# EAGLE design sandwich (EAGLE 6.4)
Sandwich v0.00 low cost CNC/3D printer controller
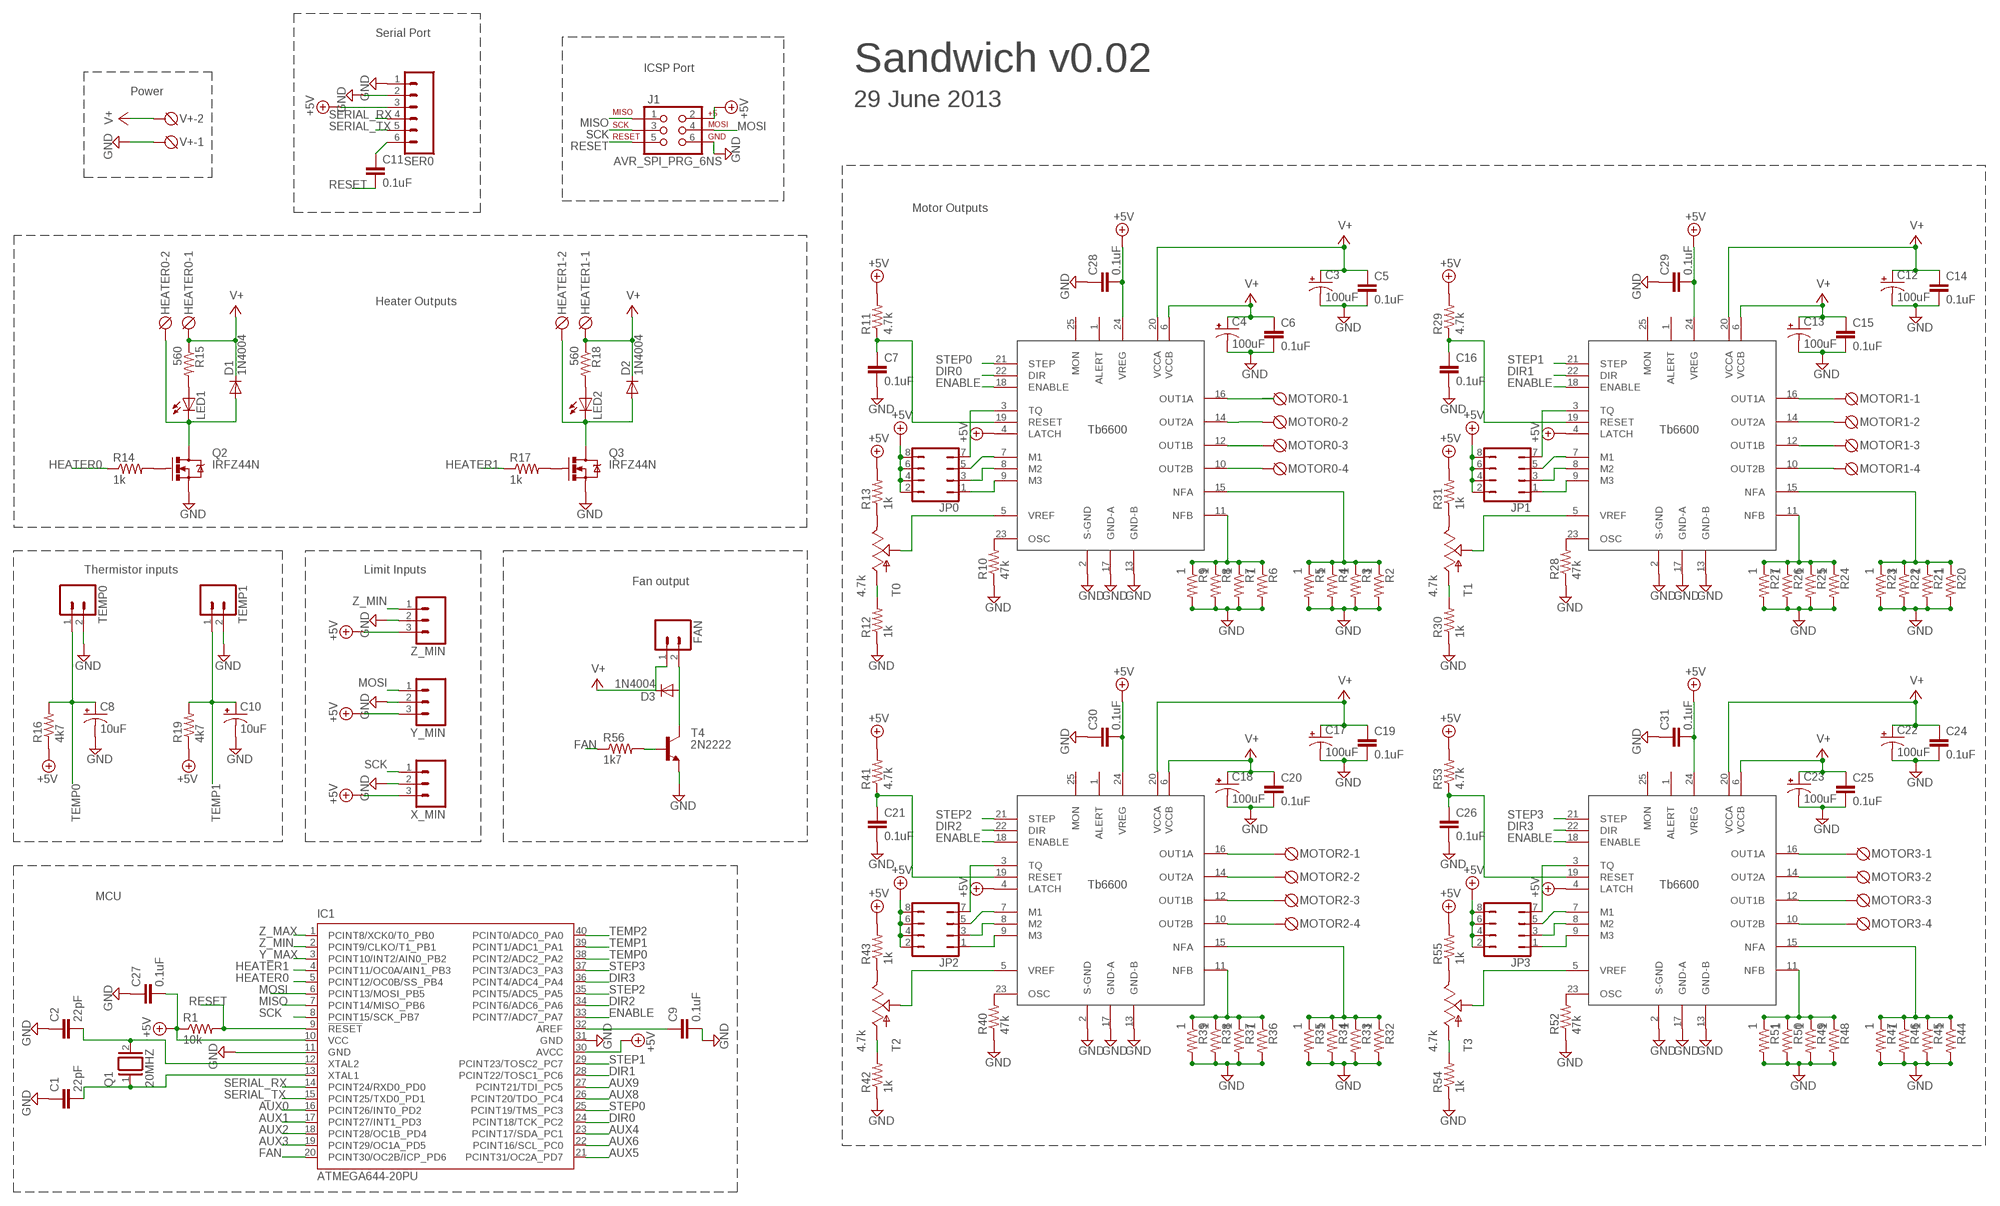
[diagram p0: schematic, sheet 1]

## Parts
C1  22pF  CAPPTH2  [CAP-PTH-SMALL2]
C2  22pF  CAPPTH2  [CAP-PTH-SMALL2]
C3  100uF  CAP_POLPTH2  [CPOL-RADIAL-10UF-25V]
C4  100uF  CAP_POLPTH2  [CPOL-RADIAL-10UF-25V]
C5  0.1uF  CAPPTH  [CAP-PTH-SMALL]
C6  0.1uF  CAPPTH  [CAP-PTH-SMALL]
C7  0.1uF  CAPPTH  [CAP-PTH-SMALL]
C8  10uF  CAP_POLPTH2  [CPOL-RADIAL-10UF-25V]
C9  0.1uF  CAPPTH  [CAP-PTH-SMALL]
C10  10uF  CAP_POLPTH2  [CPOL-RADIAL-10UF-25V]
C11  0.1uF  CAPPTH  [CAP-PTH-SMALL]
C12  100uF  CAP_POLPTH2  [CPOL-RADIAL-10UF-25V]
C13  100uF  CAP_POLPTH2  [CPOL-RADIAL-10UF-25V]
C14  0.1uF  CAPPTH  [CAP-PTH-SMALL]
C15  0.1uF  CAPPTH  [CAP-PTH-SMALL]
C16  0.1uF  CAPPTH  [CAP-PTH-SMALL]
C17  100uF  CAP_POLPTH2  [CPOL-RADIAL-10UF-25V]
C18  100uF  CAP_POLPTH2  [CPOL-RADIAL-10UF-25V]
C19  0.1uF  CAPPTH  [CAP-PTH-SMALL]
C20  0.1uF  CAPPTH  [CAP-PTH-SMALL]
C21  0.1uF  CAPPTH  [CAP-PTH-SMALL]
C22  100uF  CAP_POLPTH2  [CPOL-RADIAL-10UF-25V]
C23  100uF  CAP_POLPTH2  [CPOL-RADIAL-10UF-25V]
C24  0.1uF  CAPPTH  [CAP-PTH-SMALL]
C25  0.1uF  CAPPTH  [CAP-PTH-SMALL]
C26  0.1uF  CAPPTH  [CAP-PTH-SMALL]
C27  0.1uF  CAPPTH  [CAP-PTH-SMALL]
C28  0.1uF  CAPPTH  [CAP-PTH-SMALL]
C29  0.1uF  CAPPTH  [CAP-PTH-SMALL]
C30  0.1uF  CAPPTH  [CAP-PTH-SMALL]
C31  0.1uF  CAPPTH  [CAP-PTH-SMALL]
D1  1N4004  [DO41-10]
D2  1N4004  [DO41-10]
D3  1N4004  DIODEPTH  [DIODE-1N4001]
FAN  M02PTH3  [1X02_LONGPADS]
HEATER0  DG3XX-02-3.5  [DG350-3.5-02P]
HEATER1  DG3XX-02-3.5  [DG350-3.5-02P]
IC1  ATMEGA644-20PU  [DIL40]
J1  AVR_SPI_PRG_6NS  [2X3-NS]
JP0  JP4Q  [JP4Q]
JP1  JP4Q  [JP4Q]
JP2  JP4Q  [JP4Q]
JP3  JP4Q  [JP4Q]
LED1  LED5MM  [LED5MM]
LED2  LED5MM  [LED5MM]
MOTOR0  DG3XX-04-3.5  [DG350-3.5-04P]
MOTOR1  DG3XX-04-3.5  [DG350-3.5-04P]
MOTOR2  DG3XX-04-3.5  [DG350-3.5-04P]
MOTOR3  DG3XX-04-3.5  [DG350-3.5-04P]
Q1  20MHZ  XTAL/S  [QS]
Q2  IRFZ44N  MOSFET-NCHANNELFQP30N06L  [TO220V]
Q3  IRFZ44N  MOSFET-NCHANNELFQP30N06L  [TO220V]
R1  10k  R-US_0204/2V  [0204V]
R2  1  R-US_0204/2V  [0204V]
R3  1  R-US_0204/2V  [0204V]
R4  1  R-US_0204/2V  [0204V]
R5  1  R-US_0204/2V  [0204V]
R6  1  R-US_0204/2V  [0204V]
R7  1  R-US_0204/2V  [0204V]
R8  1  R-US_0204/2V  [0204V]
R9  1  R-US_0204/2V  [0204V]
R10  47k  R-US_0204/2V  [0204V]
R11  4.7k  R-US_0204/2V  [0204V]
R12  1k  R-US_0204/2V  [0204V]
R13  1k  R-US_0204/2V  [0204V]
R14  1k  R-US_0204/2V  [0204V]
R15  560  R-US_0204/2V  [0204V]
R16  4k7  R-US_0204/2V  [0204V]
R17  1k  R-US_0204/2V  [0204V]
R18  560  R-US_0204/2V  [0204V]
R19  4k7  R-US_0204/2V  [0204V]
R20  1  R-US_0204/2V  [0204V]
R21  1  R-US_0204/2V  [0204V]
R22  1  R-US_0204/2V  [0204V]
R23  1  R-US_0204/2V  [0204V]
R24  1  R-US_0204/2V  [0204V]
R25  1  R-US_0204/2V  [0204V]
R26  1  R-US_0204/2V  [0204V]
R27  1  R-US_0204/2V  [0204V]
R28  47k  R-US_0204/2V  [0204V]
R29  4.7k  R-US_0204/2V  [0204V]
R30  1k  R-US_0204/2V  [0204V]
R31  1k  R-US_0204/2V  [0204V]
R32  1  R-US_0204/2V  [0204V]
R33  1  R-US_0204/2V  [0204V]
R34  1  R-US_0204/2V  [0204V]
R35  1  R-US_0204/2V  [0204V]
R36  1  R-US_0204/2V  [0204V]
R37  1  R-US_0204/2V  [0204V]
R38  1  R-US_0204/2V  [0204V]
R39  1  R-US_0204/2V  [0204V]
R40  47k  R-US_0204/2V  [0204V]
R41  4.7k  R-US_0204/2V  [0204V]
R42  1k  R-US_0204/2V  [0204V]
R43  1k  R-US_0204/2V  [0204V]
R44  1  R-US_0204/2V  [0204V]
R45  1  R-US_0204/2V  [0204V]
R46  1  R-US_0204/2V  [0204V]
R47  1  R-US_0204/2V  [0204V]
R48  1  R-US_0204/2V  [0204V]
R49  1  R-US_0204/2V  [0204V]
R50  1  R-US_0204/2V  [0204V]
R51  1  R-US_0204/2V  [0204V]
R52  47k  R-US_0204/2V  [0204V]
R53  4.7k  R-US_0204/2V  [0204V]
R54  1k  R-US_0204/2V  [0204V]
R55  1k  R-US_0204/2V  [0204V]
R56  1k7  R-US_0204/2V  [0204V]
SER0  M06SIP  [1X06]
T0  4.7k  POTTRIM  [TRIM_POT]
T1  4.7k  POTTRIM  [TRIM_POT]
T2  4.7k  POTTRIM  [TRIM_POT]
T3  4.7k  POTTRIM  [TRIM_POT]
T4  2N2222  [TO18]
TEMP0  M02PTH3  [1X02_LONGPADS]
TEMP1  M02PTH3  [1X02_LONGPADS]
U$1  TB6600HG  [P-HZIP25-1.00G]
U$2  TB6600HG  [P-HZIP25-1.00G]
U$3  TB6600HG  [P-HZIP25-1.00G]
U$4  TB6600HG  [P-HZIP25-1.00G]
V+  DG3XX-02-3.5  [DG350-3.5-02P]
X_MIN  M03LONGPADS  [1X03_LONGPADS]
Y_MIN  M03LONGPADS  [1X03_LONGPADS]
Z_MIN  M03LONGPADS  [1X03_LONGPADS]

## Nets
+5V: C27.2 C28.2 C29.2 C30.2 C31.2 IC1.10(VCC) IC1.30(AVCC) J1.2 JP0.2 JP0.4 JP0.6 JP0.8 JP1.2 JP1.4 JP1.6 JP1.8 JP2.2 JP2.4 JP2.6 JP2.8 JP3.2 JP3.4 JP3.6 JP3.8 R1.1 R11.2 R13.2 R16.1 R19.1 R29.2 R31.2 R41.2 R43.2 R53.2 R55.2 SER0.3 U$1.4(LATCH) U$1.24(VREG) U$2.4(LATCH) U$2.24(VREG) U$3.4(LATCH) U$3.24(VREG) U$4.4(LATCH) U$4.24(VREG) X_MIN.3 Y_MIN.3 Z_MIN.3
AUX0: IC1.16(PCINT26/INT0_PD2)
AUX1: IC1.17(PCINT27/INT1_PD3)
AUX2: IC1.18(PCINT28/OC1B_PD4)
AUX3: IC1.19(PCINT29/OC1A_PD5)
AUX4: IC1.23(PCINT17/SDA_PC1)
AUX5: IC1.21(PCINT31/OC2A_PD7)
AUX6: IC1.22(PCINT16/SCL_PC0)
AUX8: IC1.26(PCINT20/TDO_PC4)
AUX9: IC1.27(PCINT21/TDI_PC5)
DIR0: IC1.24(PCINT18/TCK_PC2) U$1.22(DIR)
DIR1: IC1.28(PCINT22/TOSC1_PC6) U$2.22(DIR)
DIR2: IC1.34(PCINT6/ADC6_PA6) U$3.22(DIR)
DIR3: IC1.36(PCINT4/ADC4_PA4) U$4.22(DIR)
ENABLE: IC1.33(PCINT7/ADC7_PA7) U$1.18(ENABLE) U$2.18(ENABLE) U$3.18(ENABLE) U$4.18(ENABLE)
FAN: IC1.20(PCINT30/OC2B/ICP_PD6) R56.1
GND: C1.1 C2.1 C3.2(-) C4.2(-) C5.2 C6.2 C7.2 C8.2(-) C9.2 C10.2(-) C12.2(-) C13.2(-) C14.2 C15.2 C16.2 C17.2(-) C18.2(-) C19.2 C20.2 C21.2 C22.2(-) C23.2(-) C24.2 C25.2 C26.2 C27.1 C28.1 C29.1 C30.1 C31.1 IC1.11(GND) IC1.31(GND) J1.6 Q2.3(S) Q3.3(S) R2.2 R3.2 R4.2 R5.2 R6.2 R7.2 R8.2 R9.2 R10.1 R12.1 R20.2 R21.2 R22.2 R23.2 R24.2 R25.2 R26.2 R27.2 R28.1 R30.1 R32.2 R33.2 R34.2 R35.2 R36.2 R37.2 R38.2 R39.2 R40.1 R42.1 R44.2 R45.2 R46.2 R47.2 R48.2 R49.2 R50.2 R51.2 R52.1 R54.1 SER0.1 SER0.2 T4.1(E) TEMP0.2 TEMP1.2 U$1.2(S-GND) U$1.13(GND-B) U$1.17(GND-A) U$2.2(S-GND) U$2.13(GND-B) U$2.17(GND-A) U$3.2(S-GND) U$3.13(GND-B) U$3.17(GND-A) U$4.2(S-GND) U$4.13(GND-B) U$4.17(GND-A) V+.1 X_MIN.2 Y_MIN.2 Z_MIN.2
HEATER0: IC1.5(PCINT12/OC0B/SS_PB4) R14.1
HEATER1: IC1.4(PCINT11/OC0A/AIN1_PB3) R17.1
MISO: IC1.7(PCINT14/MISO_PB6) J1.1
MOSI: IC1.6(PCINT13/MOSI_PB5) J1.4 Y_MIN.1
N$1: C2.2 IC1.12(XTAL2) Q1.2
N$2: C1.2 IC1.13(XTAL1) Q1.1
N$3: R10.2 U$1.23(OSC)
N$4: R2.1 R3.1 R4.1 R5.1 U$1.15(NFA)
N$5: R6.1 R7.1 R8.1 R9.1 U$1.11(NFB)
N$6 [motor]: MOTOR0.4 U$1.10(OUT2B)
N$7 [motor]: MOTOR0.3 U$1.12(OUT1B)
N$8 [motor]: MOTOR0.2 U$1.14(OUT2A)
N$9 [motor]: MOTOR0.1 U$1.16(OUT1A)
N$10: R12.2 T0.3(A)
N$11: R13.1 T0.2(E)
N$12: T0.1(S) U$1.5(VREF)
N$13: Q2.1(G) R14.2
N$14: LED1.A R15.2
N$15 [heater]: D1.A HEATER0.2 LED1.K(C) Q2.2(D)
N$16: C7.1 R11.1 U$1.19(RESET)
N$17: C9.1 IC1.32(AREF)
N$18: JP0.1 U$1.9(M3)
N$19: Q3.1(G) R17.2
N$20: LED2.A R18.2
N$21 [heater]: D2.A HEATER1.2 LED2.K(C) Q3.2(D)
N$22: JP0.3 U$1.8(M2)
N$23: JP0.5 U$1.7(M1)
N$24: JP0.7 U$1.3(TQ)
N$25: C11.1 SER0.6
N$26: D3.A FAN.2 T4.3(C)
N$27: R20.1 R21.1 R22.1 R23.1 U$2.15(NFA)
N$28: R24.1 R25.1 R26.1 R27.1 U$2.11(NFB)
N$29: R28.2 U$2.23(OSC)
N$30 [motor]: MOTOR1.1 U$2.16(OUT1A)
N$31 [motor]: MOTOR1.2 U$2.14(OUT2A)
N$32 [motor]: MOTOR1.3 U$2.12(OUT1B)
N$33 [motor]: MOTOR1.4 U$2.10(OUT2B)
N$34: C16.1 R29.1 U$2.19(RESET)
N$35: R30.2 T1.3(A)
N$36: R31.1 T1.2(E)
N$37: T1.1(S) U$2.5(VREF)
N$38: JP1.1 U$2.9(M3)
N$39: JP1.3 U$2.8(M2)
N$40: JP1.5 U$2.7(M1)
N$41: JP1.7 U$2.3(TQ)
N$42: R32.1 R33.1 R34.1 R35.1 U$3.15(NFA)
N$43: R36.1 R37.1 R38.1 R39.1 U$3.11(NFB)
N$44: R40.2 U$3.23(OSC)
N$45 [motor]: MOTOR2.1 U$3.16(OUT1A)
N$46 [motor]: MOTOR2.2 U$3.14(OUT2A)
N$47 [motor]: MOTOR2.3 U$3.12(OUT1B)
N$48 [motor]: MOTOR2.4 U$3.10(OUT2B)
N$49: C21.1 R41.1 U$3.19(RESET)
N$50: R42.2 T2.3(A)
N$51: R43.1 T2.2(E)
N$52: T2.1(S) U$3.5(VREF)
N$53: JP2.1 U$3.9(M3)
N$54: JP2.3 U$3.8(M2)
N$55: JP2.5 U$3.7(M1)
N$56: JP2.7 U$3.3(TQ)
N$57: R44.1 R45.1 R46.1 R47.1 U$4.15(NFA)
N$58: R48.1 R49.1 R50.1 R51.1 U$4.11(NFB)
N$59: R52.2 U$4.23(OSC)
N$60 [motor]: MOTOR3.1 U$4.16(OUT1A)
N$61 [motor]: MOTOR3.2 U$4.14(OUT2A)
N$62 [motor]: MOTOR3.3 U$4.12(OUT1B)
N$63 [motor]: MOTOR3.4 U$4.10(OUT2B)
N$64: C26.1 R53.1 U$4.19(RESET)
N$65: R54.2 T3.3(A)
N$66: R55.1 T3.2(E)
N$67: T3.1(S) U$4.5(VREF)
N$68: JP3.1 U$4.9(M3)
N$69: JP3.3 U$4.8(M2)
N$70: JP3.5 U$4.7(M1)
N$71: JP3.7 U$4.3(TQ)
N$73: R56.2 T4.2(B)
RESET: C11.2 IC1.9(!RESET) J1.5 R1.2
SCK: IC1.8(PCINT15/SCK_PB7) J1.3 X_MIN.1
SERIAL_RX: IC1.14(PCINT24/RXD0_PD0) SER0.4
SERIAL_TX: IC1.15(PCINT25/TXD0_PD1) SER0.5
STEP0: IC1.25(PCINT19/TMS_PC3) U$1.21(STEP)
STEP1: IC1.29(PCINT23/TOSC2_PC7) U$2.21(STEP)
STEP2: IC1.35(PCINT5/ADC5_PA5) U$3.21(STEP)
STEP3: IC1.37(PCINT3/ADC3_PA3) U$4.21(STEP)
TEMP0: C8.1(+) IC1.38(PCINT2/ADC2_PA2) R16.2 TEMP0.1
TEMP1: C10.1(+) IC1.39(PCINT1/ADC1_PA1) R19.2 TEMP1.1
TEMP2: IC1.40(PCINT0/ADC0_PA0)
V+ [heater]: C3.1(+) C4.1(+) C5.1 C6.1 C12.1(+) C13.1(+) C14.1 C15.1 C17.1(+) C18.1(+) C19.1 C20.1 C22.1(+) C23.1(+) C24.1 C25.1 D1.C D2.C D3.C FAN.1 HEATER0.1 HEATER1.1 R15.1 R18.1 U$1.6(VCCB) U$1.20(VCCA) U$2.6(VCCB) U$2.20(VCCA) U$3.6(VCCB) U$3.20(VCCA) U$4.6(VCCB) U$4.20(VCCA) V+.2
Y_MAX: IC1.3(PCINT10/INT2/AIN0_PB2)
Z_MAX: IC1.1(PCINT8/XCK0/T0_PB0)
Z_MIN: IC1.2(PCINT9/CLKO/T1_PB1) Z_MIN.1
Unconnected: U$1.1(ALERT) U$1.25(MON) U$2.1(ALERT) U$2.25(MON) U$3.1(ALERT) U$3.25(MON) U$4.1(ALERT) U$4.25(MON)

## Notes on the sheet
- Serial Port
- ICSP Port | Sandwich v0.02
- Power
- 29 June 2013
- Motor Outputs
- Heater Outputs
- Thermistor inputs | Limit Inputs
- Fan output
- MCU

## Library data of the parts
C1 C2 C5-C7 C9 C14-C16 C19-C21 C24-C31 = SparkFun-Capacitors:CAP: Capacitor Standard 0603 ceramic capacitor, and 0.1" leaded capacitor.
C3 C4 C12 C13 C17 C18 C22 C23 = SparkFun-Passives:CAP_POL: Capacitor Polarized These are standard SMD and PTH capacitors. Normally 10uF, 47uF, and 100uF in electrolytic and tantalum varieties. Always verify the external diameter of the through hole cap, it varies with capacity, voltage, and manufacturer. The EIA devices should be standard.
C8 C10 = SparkFun-Capacitors:CAP_POL: Capacitor Polarized These are standard SMD and PTH capacitors. Normally 10uF, 47uF, and 100uF in electrolytic and tantalum varieties. Always verify the external diameter of the through hole cap, it varies with capacity, voltage, and manufacturer. The EIA devices should be standard.
C11 = SparkFun-Passives:CAP: Capacitor Standard 0603 ceramic capacitor, and 0.1" leaded capacitor.
D1 D2 = diode:1N4004: DIODE general purpose rectifier, 1 A
D3 = SparkFun-DiscreteSemi:DIODE: Diode These are standard reverse protection diodes and small signal diodes. SMA package can handle up to about 1A. SOD-323 can handle about 200mA. What the SOD-323 package when ordering, there are some mfgs out there that are 5-pin packages.
FAN TEMP0 TEMP1 = SparkFun-Connectors:M02: Header 2 Standard 2-pin 0.1" header. Use with straight break away headers (SKU : PRT-00116), right angle break away headers (PRT-00553), swiss pins (PRT-00743), machine pins (PRT-00117), and female headers (PRT-00115). Molex polarized connector foot print use with SKU : PRT-08233 with associated crimp pins and housings.
HEATER0 HEATER1 V+ = degson:DG3XX-02: DG350-3.5-02P DG306-5.0-02P
IC1 = atmel:ATMEGA644-*PU: 8-bit Microcontroller with 64K Bytes In-System Programmable Flash Auto generated by make-symbol-device-package-bsdl.ulp Rev. 34 Source: http://www.atmel.com/dyn/resources/prod_documents/doc2593.pdf; MPN: ATMEGA644-20PU; OC_FARNELL: 1288340; OC_NEWARK: 23M5060
J1 = SparkFun-Connectors:AVR_SPI_PRG_6: AVR ISP 6 Pin This is the reduced ISP connector for AVR programming. Common on Arduino. This footprint will take up less PCB space and can be used with a 10-pin to 6-pin adapter such as SKU: BOB-08508
JP0 JP1-JP3 = jumper:JP4Q: JUMPER
LED1 LED2 = led:LED: LED OSRAM: - CHIPLED LG R971, LG N971, LY N971, LG Q971, LY Q971, LO R971, LY R971 LH N974, LH R974 LS Q976, LO Q976, LY Q976 LO Q996 - Hyper CHIPLED LW Q18S LB Q993, LB Q99A, LB R99A - SideLED LS A670, LO A670, LY A670, LG A670, LP A670 LB A673, LV A673, LT A673, LW A673 LH A674 LY A675 LS A676, LA A676, LO A676, LY A676, LW A676 LS A679, LY A679, LG A679 - Hyper Micro SIDELED® LS Y876, LA Y876, LO Y876, LY Y876 LT Y87S - SmartLED LW L88C, LW L88S LB L89C, LB L89S, LG L890 LS L89K, LO L89K, LY L89K LS L896, LA L896, LO L896, LY L896 - TOPLED LS T670, LO T670, LY T670, LG T670, LP T670 LSG T670, LSP T670, LSY T670, LOP T670, LYG T670 LG T671, LOG T671, LSG T671 LB T673, LV T673, LT T673, LW T673 LH T674 LS T676, LA T676, LO T676, LY T676, LB T676, LH T676, LSB T676, LW T676 LB T67C, LV T67C, LT T67C, LS T67K, LO T67K, LY T67K, LW E67C LS E67B, LA E67B, LO E67B, LY E67B, LB E67C, LV E67C, LT E67C LW T67C LS T679, LY T679, LG T679 LS T770, LO T770, LY T770, LG T770, LP T770 LB T773, LV T773, LT T773, LW T773 LH T774 LS E675, LA E675, LY E675, LS T675 LS T776, LA T776, LO T776, LY T776, LB T776 LHGB T686 LT T68C, LB T68C - Hyper Mini TOPLED® LB M676 - Mini TOPLED Santana® LG M470 LS M47K, LO M47K, LY M47K Source: http://www.osram.convergy.de LUXEON: - LUMILED® LXK2-PW12-R00, LXK2-PW12-S00, LXK2-PW14-U00, LXK2-PW14-V00 LXK2-PM12-R00, LXK2-PM12-S00, LXK2-PM14-U00 LXK2-PE12-Q00, LXK2-PE12-R00, LXK2-PE12-S00, LXK2-PE14-T00, LXK2-PE14-U00 LXK2-PB12-K00, LXK2-PB12-L00, LXK2-PB12-M00, LXK2-PB14-N00, LXK2-PB14-P00, LXK2-PB14-Q00 LXK2-PR12-L00, LXK2-PR12-M00, LXK2-PR14-Q00, LXK2-PR14-R00 LXK2-PD12-Q00, LXK2-PD12-R00, LXK2-PD12-S00 LXK2-PH12-R00, LXK2-PH12-S00 LXK2-PL12-P00, LXK2-PL12-Q00, LXK2-PL12-R00 Source: www.luxeon.com KINGBRIGHT: KA-3528ASYC Source: www.kingbright.com
MOTOR0 MOTOR1-MOTOR3 = degson:DG3XX-04: DG350-3.5-04P DG306-5.0-04P
Q1 = special:XTAL/S: CRYSTAL
Q2 Q3 = SparkFun-DiscreteSemi:MOSFET-NCHANNEL: Common NMOSFET Parts MFG P/N Store ID Prod ID FDD8780 TRANS-09984 SI7820DN TRANS-11055 FDS6630A IC-08089 2N7002PW TRANS-11151 FQP30N06L COM-10213 TRANS-10060 BSS123LT1G TRANS-08345 BSS138 TRANS-00830 BS170 2N7000; PROD_ID: TRANS-10060
R1-R56 = resistor:R-US_: RESISTOR, American symbol
SER0 = SparkFun-Connectors:M06: Header 6 Standard 6-pin 0.1" header. Use with straight break away headers (SKU : PRT-00116), right angle break away headers (PRT-00553), swiss pins (PRT-00743), machine pins (PRT-00117), and female headers (PRT-00115). Molex polarized connector foot print use with SKU : PRT-08094 with associated crimp pins and housings. NOTES ON THE VARIANTS LOCK and LOCK_LONGPADS... This footprint was designed to help hold the alignment of a through-hole component (i.e. 6-pin header) while soldering it into place. You may notice that each hole has been shifted either up or down by 0.005 of an inch from it's more standard position (which is a perfectly straight line). This slight alteration caused the pins (the squares in the middle) to touch the edges of the holes. Because they are alternating, it causes a "brace" to hold the component in place. 0.005 has proven to be the perfect amount of "off-center" position when using our standard breakaway headers. Although looks a little odd when you look at the bare footprint, once you have a header in there, the alteration is very hard to notice. Also, if you push a header all the way into place, it is covered up entirely on the bottom side. This idea of altering the position of holes to aid alignment will be further integrated into the Sparkfun Library for other footprints. It can help hold any component with 3 or more connection pins.
T0 T1-T3 = SparkFun-Electromechanical:POT
T4 = transistor:2N2222: NPN TRANSISTOR
U$1-U$4 = tb6600hq:TB6600
X_MIN Y_MIN Z_MIN = SparkFun-Connectors:M03: Header 3 Standard 3-pin 0.1" header. Use with straight break away headers (SKU : PRT-00116), right angle break away headers (PRT-00553), swiss pins (PRT-00743), machine pins (PRT-00117), and female headers (PRT-00115). Molex polarized connector foot print use with SKU : PRT-08232 with associated crimp pins and housings.

## Net classes
0 default: width 0.381 mm, clearance 0.356 mm
1 heater: width 1.626 mm, clearance 0.356 mm
2 motor: width 1.626 mm, clearance 0.356 mm
3 V+: width 1.626 mm, clearance 0.356 mm

## Board
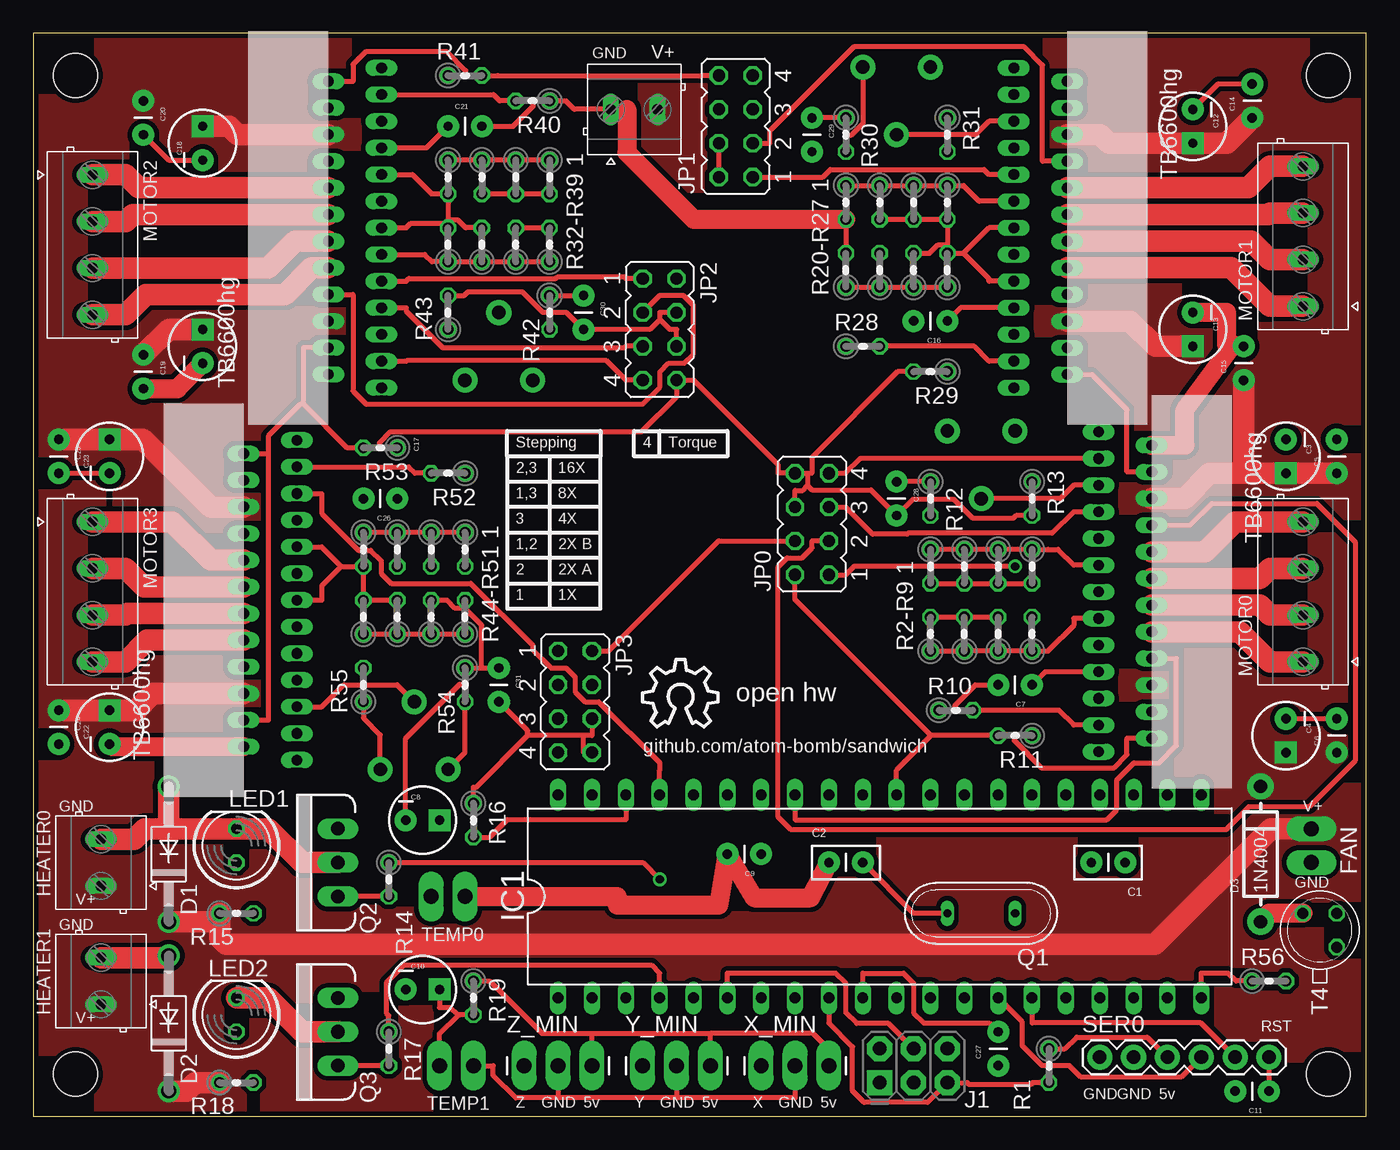
[diagram p1: board, top side]
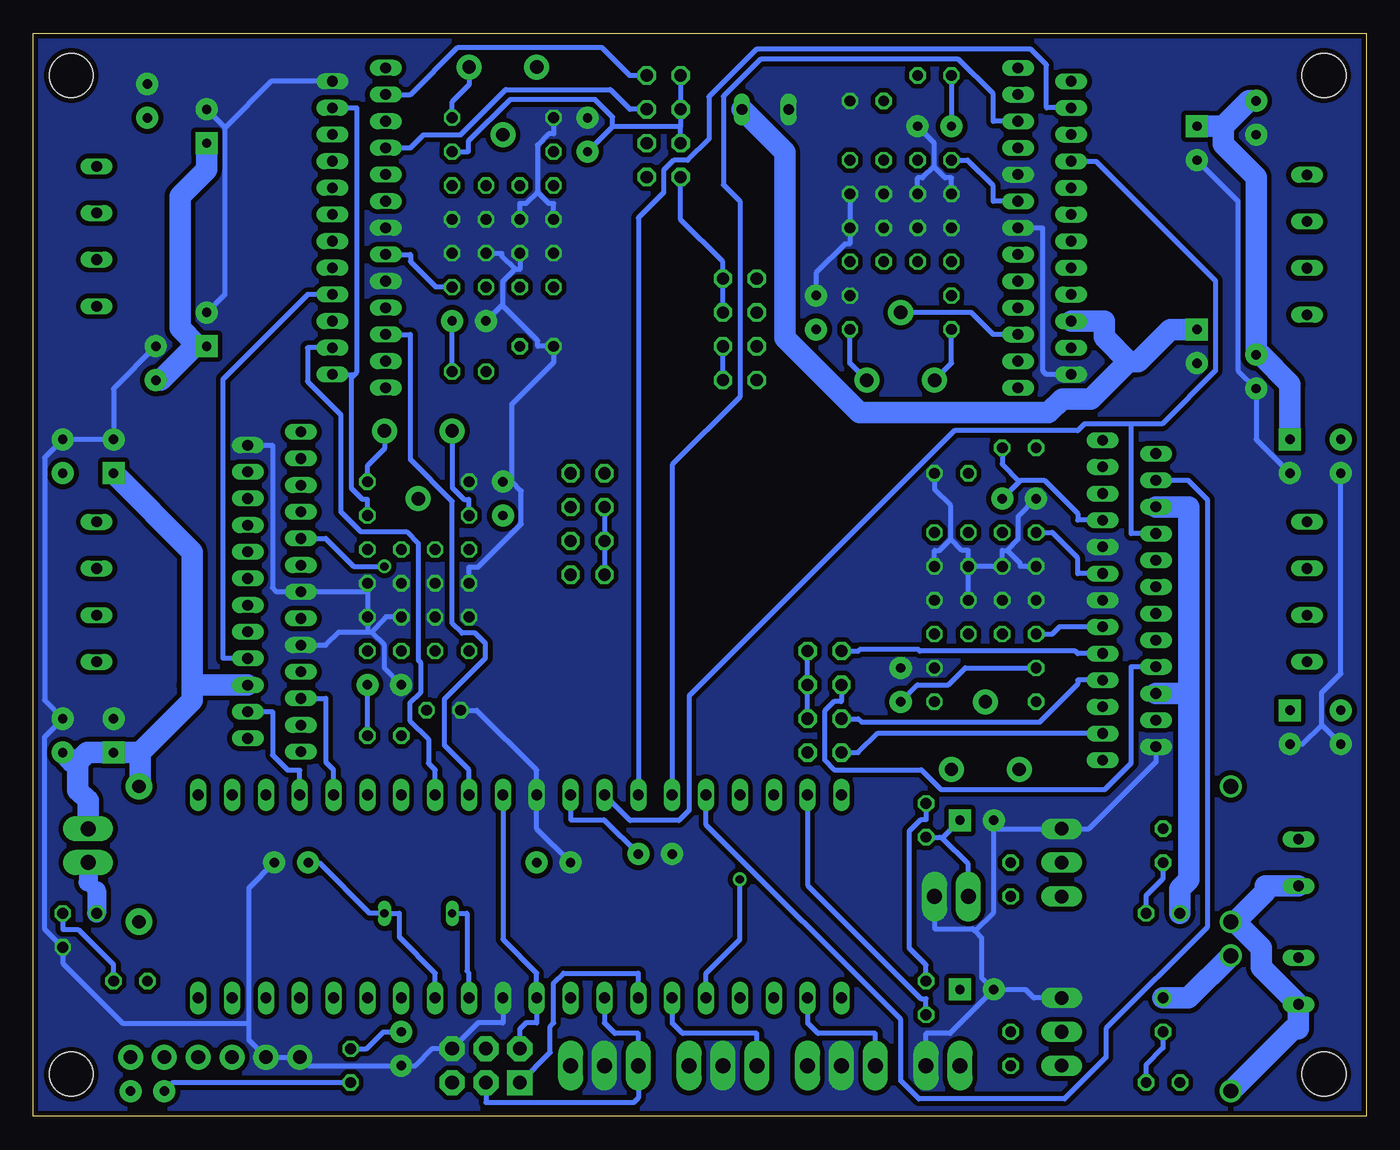
[diagram p2: board, bottom side, seen from below]

Size 100 x 81.27 mm. Coordinates in mm from the lower left corner, seen from the top.
Outline: 0,0 100,0 100,81.27 0,81.27 0,0
Copper layers (1*16): Top 0.0356mm / dielectric 1.5011mm / Bottom 0.0356mm
Design rules "LaenPCBOrder": minimum track width 6mil, minimum drill 13mil, track to track 6mil, track to pad 6mil, pad to pad 6mil, via to via 6mil, smd to smd 6mil, copper to edge 15mil, drill to drill 6mil, minimum pad ring 7mil, minimum via ring 7mil, stop-mask expansion 3mil, vias tented up to drill 0mil, thermal gap 10mil

### Footprints (pad centres in the part's own frame; a part is rotated, then mirrored left to right if it is on the bottom)
CAP-PTH-SMALL2 = drill 0.7 pad 1.651: 1 0,0; 2 2.54,0
CPOL-RADIAL-10UF-25V = drill 0.7 pad 1.651 square: 1 1.27,0 | drill 0.7 pad 1.651: 2 -1.27,0
CAP-PTH-SMALL = drill 0.7 pad 1.651: 1 0,0; 2 2.54,0
DO41-10 = drill 1.118: A 5.08,0; C -5.08,0
DIODE-1N4001 = drill 1 pad 1.981: A -5.08,0; C 5.08,0
1X02_LONGPADS = drill 1.118 pad 1.88 long: 1 0,0; 2 2.54,0
DG350-3.5-02P = drill 0.8 long: 1 -1.75,0; 2 1.75,0
DIL40 = drill 0.813 long: 1 -24.13,-7.62; 2 -21.59,-7.62; 3 -19.05,-7.62; 4 -16.51,-7.62; 5 -13.97,-7.62; 6 -11.43,-7.62; 7 -8.89,-7.62; 8 -6.35,-7.62; 9 -3.81,-7.62; 10 -1.27,-7.62; 11 1.27,-7.62; 12 3.81,-7.62; 13 6.35,-7.62; 14 8.89,-7.62; 15 11.43,-7.62; 16 13.97,-7.62; 17 16.51,-7.62; 18 19.05,-7.62; 19 21.59,-7.62; 20 24.13,-7.62; 21 24.13,7.62; 22 21.59,7.62; 23 19.05,7.62; 24 16.51,7.62; 25 13.97,7.62; 26 11.43,7.62; 27 8.89,7.62; 28 6.35,7.62; 29 3.81,7.62; 30 1.27,7.62; 31 -1.27,7.62; 32 -3.81,7.62; 33 -6.35,7.62; 34 -8.89,7.62; 35 -11.43,7.62; 36 -13.97,7.62; 37 -16.51,7.62; 38 -19.05,7.62; 39 -21.59,7.62; 40 -24.13,7.62
2X3-NS = drill 1.016 pad 1.88 square: 1 -2.54,-1.27 | drill 1.016 pad 1.88 octagon: 2 -2.54,1.27; 3 0,-1.27; 4 0,1.27; 5 2.54,-1.27; 6 2.54,1.27
JP4Q = drill 0.914 octagon: 1 -3.81,-1.27; 2 -3.81,1.27; 3 -1.27,-1.27; 4 -1.27,1.27; 5 1.27,-1.27; 6 1.27,1.27; 7 3.81,-1.27; 8 3.81,1.27
LED5MM = drill 0.813 octagon: A -1.27,0; K 1.27,0
DG350-3.5-04P = drill 0.8 long: 1 -5.25,0; 2 -1.75,0; 3 1.75,0; 4 5.25,0
QS = drill 0.61 long: 1 -2.54,0; 2 2.54,0
TO220V = drill 1.016 long: 1 -2.54,0; 2 0,0; 3 2.54,0
0204V = drill 0.813 octagon: 1 -1.27,0; 2 1.27,0
1X06 = drill 1.016 pad 1.88: 1 0,0; 2 2.54,0; 3 5.08,0; 4 7.62,0; 5 10.16,0; 6 12.7,0
TRIM_POT = drill 1 pad 1.88: 1 5.08,0; 2 0,2.54; 3 0,-2.54
TO18 = drill 0.813 octagon: 1 -1.27,-1.27; 2 1.27,-1.27; 3 1.27,1.27
P-HZIP25-1.00G = drill 0.8 long: 1 -12,-2; 2 -11,2; 3 -10,-2; 4 -9,2; 5 -8,-2; 6 -7,2; 7 -6,-2; 8 -5,2; 9 -4,-2; 10 -3,2; 11 -2,-2; 12 -1,2; 13 0,-2; 14 1,2; 15 2,-2; 16 3,2; 17 4,-2; 18 5,2; 19 6,-2; 20 7,2; 21 8,-2; 22 9,2; 23 10,-2; 24 11,2; 25 12,-2
STAND-OFF = hole 3.302: 0,0
1X03_LONGPADS = drill 1.118 pad 1.88 long: 1 0,0; 2 2.54,0; 3 5.08,0

### Placement (x,y rotation side)
C1  81.92,19.05 180 top
C2  59.69,19.05 0 top
C3  93.98,49.53 270 top
C4  93.98,28.57 270 top
C5  97.79,48.26 90 top
C6  97.79,27.3 90 top
C7  74.93,32.38 180 top
C8  29.21,22.23 0 top
C9  54.61,19.68 180 top
C10  29.21,9.53 0 top
C11  92.71,1.91 180 top
C12  87,74.3 270 top
C13  87,59.05 270 top
C14  91.44,74.93 90 top
C15  90.81,55.24 90 top
C16  68.58,59.69 180 top
C17  12.7,57.78 90 top
C18  12.7,73.03 90 top
C19  8.26,57.15 270 top
C20  8.26,76.2 270 top
C21  31.11,74.3 0 top
C22  5.71,29.21 90 top
C23  5.71,49.53 90 top
C24  1.91,30.48 270 top
C25  1.91,50.8 270 top
C26  27.3,46.35 180 top
C27  72.39,3.81 90 top
C28  64.77,47.62 270 top
C29  58.42,74.93 270 top
C30  41.27,61.59 270 top
C31  34.92,33.66 270 top
D1  10.16,19.68 90 top
D2  10.16,6.99 90 top
D3  92.08,19.68 90 top
FAN  95.89,21.59 270 top
HEATER0  5.08,19.05 90 top
HEATER1  5.08,10.16 90 top
IC1  63.5,16.51 0 top
J1  66.04,3.81 0 top
JP0  58.42,44.45 90 top
JP1  52.7,74.3 90 top
JP2  46.99,59.05 270 top
JP3  40.64,31.11 270 top
LED1  15.24,20.32 90 top
LED2  15.24,7.62 90 top
MOTOR0  95.25,39.37 90 top
MOTOR1  95.25,66.04 90 top
MOTOR2  4.45,65.41 270 top
MOTOR3  4.45,39.37 270 top
Q1  71.12,15.24 180 top
Q2  22.86,19.05 90 top
Q3  22.86,6.35 90 top
R1  76.2,3.81 270 top
R2  74.93,36.2 90 top
R3  72.39,36.2 90 top
R4  69.85,36.2 90 top
R5  67.31,36.2 90 top
R6  67.31,41.27 270 top
R7  69.85,41.27 270 top
R8  72.39,41.27 270 top
R9  74.93,41.27 270 top
R10  69.22,30.48 0 top
R11  73.66,28.57 180 top
R12  67.31,46.35 270 top
R13  74.93,46.35 270 top
R14  26.67,17.78 270 top
R15  15.24,15.24 0 top
R16  33.02,22.23 270 top
R17  26.67,5.08 270 top
R18  15.24,2.54 0 top
R19  33.02,8.89 270 top
R20  68.58,63.5 90 top
R21  66.04,63.5 90 top
R22  63.5,63.5 90 top
R23  60.96,63.5 90 top
R24  68.58,68.58 270 top
R25  66.04,68.58 270 top
R26  63.5,68.58 270 top
R27  60.96,68.58 270 top
R28  62.23,57.78 0 top
R29  67.31,55.88 180 top
R30  60.96,73.66 270 top
R31  68.58,73.66 270 top
R32  31.11,70.48 270 top
R33  33.66,70.48 270 top
R34  36.2,70.48 270 top
R35  38.73,70.48 270 top
R36  38.73,65.41 90 top
R37  36.2,65.41 90 top
R38  33.66,65.41 90 top
R39  31.11,65.41 90 top
R40  37.47,76.2 180 top
R41  32.38,78.11 0 top
R42  38.73,60.33 270 top
R43  31.11,60.33 90 top
R44  24.77,42.55 270 top
R45  27.3,42.55 270 top
R46  29.84,42.55 270 top
R47  32.38,42.55 270 top
R48  32.38,37.47 90 top
R49  29.84,37.47 90 top
R50  27.3,37.47 90 top
R51  24.77,37.47 90 top
R52  31.11,48.26 180 top
R53  26.04,50.16 180 top
R54  32.38,32.38 270 top
R55  24.77,32.38 90 top
R56  92.71,10.16 0 top
SER0  80.01,4.45 0 top
T0  71.12,51.44 270 top
T1  64.77,78.74 270 top
T2  34.92,55.24 90 top
T3  28.57,26.04 90 top
T4  96.52,13.97 90 top
TEMP0  29.84,16.51 0 top
TEMP1  30.48,3.81 0 top
U$1  81.92,39.37 270 top
U$2  75.56,66.67 270 top
U$3  24.13,66.67 90 top
U$4  17.78,38.73 90 top
U$5  [STAND-OFF]  97.16,3.17 0 top
U$6  [STAND-OFF]  97.16,78.11 0 top
U$7  [STAND-OFF]  3.17,78.11 0 top
U$8  [STAND-OFF]  3.17,3.17 0 top
U$9  [OSHW_10X200_NOTEXT]  45.72,29.21 0 top
V+  45.09,75.56 0 top
X_MIN  54.61,3.81 0 top
Y_MIN  45.72,3.81 0 top
Z_MIN  36.83,3.81 0 top

### Tracks (layer width: path | path; a pad name or v marks a point on that pad's centre or on a via)
+5V
  Top 0.381: U$4.4 17.63,29.73 17.63,49.73 | 20.28,53.45 20.04,53.45 17.63,51.05 17.63,49.73 | 20.28,53.45 20.28,57.67 U$3.4 | 20.28,53.45 23.56,50.16 R53.2 25.97,50.16 25.97,50.54 26.8,51.37 45.64,51.37 48.26,53.99 JP2.8 49.52,55.24 55.89,48.87 55.89,48.26 JP0.8 57.78,48.26 58.09,48.26 | U$4.24 17.63,49.73 | JP3.2 43.17,34.92 51.42,43.18 JP0.4 | 50.8,6.24 58.48,6.24 59.69,5.02 X_MIN.3 | JP1.2 JP1.4 | R1.1 77.41,5.08 78.28,5.96 83.58,5.96 SER0.3 | 67.35,28.57 R11.2 73.6,28.57 73.6,28.2 75.63,26.17 81.09,26.17 82.06,27.14 82.06,28.37 U$1.24 | IC1.10 62.23,10.76 65.28,10.76 66.04,10 66.04,7.79 66.8,7.02 71.72,7.02 C27.2 | 58.09,47.34 58.43,47 62.85,47 C28.2 65.99,46.3 69.07,46.3 70.5,44.87 73.51,44.87 73.72,45.09 R13.2 | 58.09,48.26 58.09,47.34 | 58.09,47.34 57.73,46.98 57.15,46.98 JP0.6 | 58.09,48.26 58.41,48.26 58.41,49.45 64.83,55.88 R29.2 | 67.35,28.57 64.77,26 IC1.30 | 47,59.8 46.25,59.05 C30.2 40.01,60.33 38.23,60.33 36.69,61.86 32.59,61.86 32.32,61.59 R43.2 | JP1.8 50.18,78.11 34.86,78.11 R41.2 32.45,78.11 32.45,78.48 31.05,79.88 24.93,79.88 23.98,78.94 23.98,77.67 U$3.24 | 67.35,28.57 57.15,38.77 JP0.2 | 41.91,6.24 50.8,6.24 | 41.91,6.24 38.15,6.24 34.23,10.16 R19.1 | Z_MIN.3 41.91,6.24 | Y_MIN.3 50.8,6.24 | 47,59.8 47,60.33 JP2.4 | 47,59.8 47.76,59.04 48.26,59.04 JP2.6 | R16.1 33.02,24.7 33.21,24.7 37.08,28.57 | 37.08,28.57 37.08,28.96 C31.2 | 41.28,28.57 37.08,28.57 | JP3.6 41.91,28.59 41.29,28.59 41.28,28.57 | 41.28,28.57 41.28,27.3 JP3.8 | U$2.24 79.42,55.67 82.06,53.03 82.06,48.37 U$1.4
  Bottom 0.381: 56.53,74.28 C29.2 | 51.44,74.28 56.53,74.28 | 56.53,74.28 56.53,74.98 57.85,76.3 64.23,76.3 67.37,73.16 67.37,72.39 R31.2 | 51.44,74.28 JP1.6 JP1.8 | R16.1 33.02,22.29 33.4,22.29 34.27,21.41 34.27,12.62 33.02,11.37 R19.1 | IC1.30 64.77,13.3 62.23,10.76 IC1.10 62.23,7.02 63.04,7.02 63.5,6.57 J1.2 | JP2.8 JP2.6 | C31.2 33.66,32.38 31.35,32.38 30.08,33.66 R55.2 | JP1.2 51.44,67.3 48.26,64.12 JP2.2 JP2.4 | 75.89,55.67 76.14,55.43 76.14,47.12 75.31,46.29 74.93,46.29 R13.2 | U$2.4 75.71,75.67 75.71,55.86 75.89,55.67 | U$2.24 75.89,55.67 | JP0.2 JP0.4 JP0.6 | JP1.4 51.44,73.11 51.44,74.28 | JP3.2 JP3.4 JP3.6 | R1.1 74.99,5.08 73.72,6.35 C27.2
DIR0
  Bottom 0.381: IC1.24 80.01,26 80.94,26 82.06,27.12 82.06,30.37 U$1.22
DIR1
  Bottom 0.381: IC1.28 69.85,26 70.35,26.5 70.35,28.32 71.76,29.72 71.76,31 70.96,31.79 70.96,34.08 71.12,34.24 71.12,42.99 72,43.87 75.42,43.87 76.93,45.37 76.93,52.66 79.42,55.15 79.42,57.67 U$2.22
DIR2
  Bottom 0.381: U$3.22 23.98,75.67 23.98,78.89 25.15,80.06 45.76,80.06 49.32,76.5 49.32,73.32 50.9,71.74 51.97,71.74 52.7,71 52.7,69.33 54.61,67.42 IC1.34
DIR3
  Bottom 0.381: U$4.22 13.37,47.73 11.93,46.3 11.93,14.19 19.53,6.6 19.53,4.42 22.64,1.31 33.57,1.31 34.92,2.66 34.92,7.27 49.53,21.88 IC1.36
ENABLE
  Top 0.381: U$1.18 85.77,34.37 85.77,27.82 84.49,26.54 82.58,26.54 81.28,25.24 81.28,23.01 80.53,22.26 57.15,22.26 IC1.33
  Bottom 0.381: 17.63,51.96 21.13,51.96 21.63,51.46 30.9,51.46 50.8,31.55 50.8,22.97 51.56,22.21 55.23,22.21 IC1.33 | 17.63,51.96 15.3,51.96 11.31,55.95 11.31,62.71 20.28,71.67 U$3.18 | 17.63,51.96 17.63,43.73 U$4.18 | U$2.18 79.42,61.67 85.77,55.33 85.77,34.37 U$1.18
FAN
  Top 0.381: R56.1 90.23,10.16 89.64,10.76 87.63,10.76 IC1.20
GND
  Top 0.381: 33.64,33.66 C31.1 | 33.64,33.66 R54.1 32.38,32.45 32.01,32.45 27.94,28.38 C8.2 | 33.64,33.66 33.64,36.88 32.38,38.13 | U$3.17 28.45,70.67 29.91,69.22 R32.2 31.11,67.28 | U$3.13 27.98,66.67 28.29,66.98 31.11,66.98 | 31.11,66.98 31.11,67.28 | R39.2 31.11,66.98 | R27.2 R23.2 | 44.53,75.56 V+.1 40.58,75.56 39.94,76.2 R40.1 37.53,76.2 37.53,75.83 36,74.3 C21.2 | 5.92,27.73 C22.2 | R21.2 67.25,64.77 67.85,65.37 68.58,65.37 | 68.58,65.37 R20.2 69.79,64.77 69.8,64.76 | R49.2 31.05,38.73 31.66,38.13 32.38,38.13 | R48.2 32.38,38.13 | 90.04,57.91 90.55,57.78 C15.2 | C12.2 88.9,77.47 C14.2 | 69.8,64.76 71.71,62.85 71.71,62.67 U$2.17 | 69.8,64.76 71.71,66.67 U$2.13 | 68.58,65.37 R24.2 R25.2 R26.2 | 48.26,1.38 39.37,1.38 | 48.26,1.38 57.15,1.38 X_MIN.2 | TEMP1.2 34.51,3.81 34.51,3.07 36.19,1.38 39.37,1.38 | Z_MIN.2 39.37,1.38 | R38.2 32.45,66.67 31.84,67.28 31.11,67.28 | R50.2 R51.2 R44.2 23.09,41.27 | 23.09,41.27 21.63,42.73 U$4.17 | 23.09,41.27 21.63,39.81 21.63,38.73 U$4.13 | R9.2 R8.2 R7.2 R6.2 | 43.81,16.51 43.81,15.88 | C6.2 C4.2 | R37.2 R36.2 | C20.2 10.16,71.75 C18.2 | C25.2 C23.2 | R3.2 R4.2 R5.2 | R10.1 69.15,30.48 69.15,30.86 70.68,32.38 C7.2 | R12.1 C28.1 | R30.1 C29.1 | R33.2 R34.2 R35.2 | R42.1 C30.1 | Y_MIN.2 48.26,1.38
  Top 1.422: 44.53,75.56 44.53,72.31 49.54,67.31 R27.2 | U$4.2 5.92,27.73 | C13.2 89.53,60.33 89.53,57.91 90.04,57.91 86.4,53 86.4,50.37 U$1.2 | C19.2 10.79,54.61 C17.2 | C2.1 58.31,16.4 54.08,16.4 C9.2 51.44,15.88 43.81,15.88 | TEMP0.2 43.81,16.51
  Bottom 0.381: 3.34,29.38 3.34,31.8 1.91,33.23 C25.2 | C24.2 3.34,29.38 | C22.2 4.78,27.94 3.34,29.38 | 64.84,60.89 64.77,60.96 64.77,62.67 63.88,63.56 | C16.2 64.84,60.89 | 64.84,60.89 62.17,58.21 62.17,57.78 R28.1 60.96,56.58 64.08,53.45 64.08,47.62 | 64.08,47.62 63.4,46.94 63.4,44.45 66.63,41.21 67.31,41.21 R6.2 | C28.1 64.08,47.62 | U$3.2 23.98,55.67 24.28,55.97 24.28,66.67 U$3.13 | C10.2 25.57,9.53 24.93,8.89 Q3.3 | 29.36,13.92 28.85,13.41 28.85,10.44 C10.2 | C10.2 | 27.94,21.59 C8.2 | 29.36,13.92 27.94,15.33 27.94,21.59 | 27.94,21.59 Q2.3 20.79,21.59 15.78,26.6 U$4.2 | 29.36,13.92 29.52,14.08 32.38,14.08 TEMP0.2 | C23.2 8.26,50.8 C19.2 9.63,55.98 9.63,68.68 C18.2 | 83.82,7 83.82,17.14 C1.1 | 83.82,7 83.82,5.71 SER0.2 SER0.1 79.38,3.81 C27.1 71.34,3.81 70.07,5.08 J1.6 66.64,7.02 64.77,7.02 IC1.11 | 83.82,7 93.3,7 97.79,11.49 T4.1 99.18,14.09 99.18,28.46 C6.2 99.16,31.22 99.16,49.43 C5.2 C3.2 93.98,54.61 C15.2 | 74.63,36.33 74.93,36.33 | C7.2 73.66,33.66 73.66,35.36 74.63,36.33 | 74.63,36.33 73.6,37.37 73.6,37.47 R3.2 | 62.17,69.36 61.34,68.52 60.96,68.52 R27.2 | 62.17,69.36 62.17,72.89 61.34,73.72 60.96,73.72 R30.1 | 62.17,69.36 63.01,68.52 63.5,68.52 R26.2 | 63.88,63.56 63.5,63.56 R22.2 | 63.88,63.56 64.83,64.52 64.83,64.77 R21.2 | 31.17,43.32 31.17,45.83 32.38,47.05 R52.1 | 31.17,43.32 32.01,42.48 32.38,42.48 R47.2 | 31.17,43.32 30.32,42.48 29.84,42.48 R46.2 | R46.2 R45.2 27.3,42.48 26.93,42.48 | C10.2 31.23,6.24 33.02,6.24 TEMP1.2 | 85.62,74.19 C12.2 | C13.2 85.62,61.7 85.62,74.19 | U$2.2 82.14,77.67 85.62,74.19 | U$1.2 82.06,50.37 82.06,39.66 81.77,39.37 U$1.13 74.93,39.37 | U$1.17 78.06,35.37 77.1,36.33 74.93,36.33
  Bottom 0.381: 74.93,36.33 R2.2 74.93,39.37 | R9.2 74.93,39.37 | R10.1 66.74,30.48 62.26,26 62.23,26 IC1.31 62.23,21.59 C2.1 | 32.44,71.26 33.28,70.42 33.66,70.42 R33.2 | C21.2 32.44,73.08 32.44,71.26 | 32.44,71.26 31.6,70.42 31.11,70.42 R32.2 | R49.2 R46.2 | 26.93,42.48 26.1,43.31 26.1,45.02 C26.2 | 26.93,42.48 25.97,41.52 25.97,41.27 R44.2 | C30.1 41.27,63.31 39.11,65.47 38.73,65.47 R36.2 R35.2
  pour Bottom (no thermals): 0,81.28 99.69,81.28 99.69,0 0,0
HEATER0  (via drill 0.61 pad 1.02)
  Top 0.381: R14.1 45.74,19.05 v47,17.79
  Bottom 0.381: IC1.5 49.53,10.76 47,13.29 v47,17.79
HEATER1
  Top 0.381: IC1.4 46.99,10.76 46.38,11.37 27.82,11.37 26.52,10.06 26.52,7.71 26.67,7.56 R17.1
MISO
  Bottom 0.381: IC1.7 54.61,10.76 60.23,10.76 60.96,10.03 60.96,7.01 61.23,6.74 61.23,4.81 J1.1
MOSI
  Top 0.381: J1.4 64.15,6.97 61.78,6.97 60.96,7.79 60.96,9.99 60.19,10.76 52.07,10.76 IC1.6
  Bottom 0.381: IC1.6 52.07,7.02 51.28,6.24 45.72,6.24 Y_MIN.1
N$1
  Top 0.381: Q1.2 66.04,15.24 C2.2
  Bottom 0.381: IC1.12 67.31,10.76 67.47,10.92 67.47,15.24 Q1.2
N$2
  Bottom 0.381: C1.2 78.58,19.05 74.77,15.24 Q1.1 72.56,15.24 72.56,13.46 69.85,10.76 IC1.13
N$3
  Top 0.381: U$1.23 78.06,29.37 76.95,30.48 R10.2
N$4
  Top 0.381: R5.1 R4.1 R3.1 R2.1 76.14,34.92 78.06,36.85 78.06,37.37 U$1.15
N$5
  Top 0.381: U$1.11 78.06,41.37 76.89,42.55 76.14,42.55 R9.1 R8.1 R7.1 R6.1
N$6
  Top 1.626: U$1.10 87.91,42.37 90.16,44.62 MOTOR0.4
N$7
  Top 1.626: U$1.12 92.02,40.37 92.77,41.12 MOTOR0.3
N$8
  Top 1.626: MOTOR0.2 92.77,37.62 92.02,38.37 U$1.14
N$9
  Top 1.626: MOTOR0.1 92.77,34.12 90.52,36.37 U$1.16
N$10
  Bottom 0.381: R12.2 67.31,46.29 67.68,46.29 68.58,47.19 T0.3
N$11
  Bottom 0.381: R13.1 74.93,48.83 73.66,50.1 T0.2
N$12
  Top 0.381: U$1.5 78.06,47.37 77.05,46.35 T0.1
N$13
  Top 0.381: R14.2 Q2.1
N$14
  Bottom 0.381: LED1.A 15.24,17.84 16.51,16.57 R15.2
N$15
  Top 1.626: Q2.2 20.17,19.05 17.63,21.59 LED1.K 13.91,21.59 10.16,21.59 | 10.16,21.59 8.35,21.59 7.56,20.8 HEATER0.2 | 10.16,21.59 D1.A
N$16
  Top 0.381: U$1.19 75.92,33.37 C7.1
  Bottom 0.381: R11.1 C7.1
N$17
  Bottom 0.381: IC1.32 59.69,22.26 57.19,22.26 C9.1
N$18  (via drill 0.61 pad 1.02)
  Top 0.381: JP0.1 60.95,40.64 61.58,41.27 v73.66,41.27
  Bottom 0.381: U$1.9 78.06,43.37 75.97,41.27 v73.66,41.27
N$19
  Top 0.381: R17.2 Q3.1
N$20
  Bottom 0.381: LED2.A 15.24,5.14 16.51,3.87 R18.2
N$21
  Top 1.626: HEATER1.2 10.01,11.91 D2.A | LED2.K 17.63,8.89 20.17,6.35 Q3.2
  Bottom 1.626: LED2.K 13.34,8.89 D2.A
N$22
  Top 0.381: JP0.3 58.43,43.18 58.43,42.66 57.68,41.91 56.55,41.91 55.88,41.23 55.88,22.48 56.85,21.51 89.48,21.51 91.19,23.23 95.71,23.23 99.17,26.69 99.17,43.12 96.3,45.99 88.41,45.99 86.78,44.37 U$1.8
N$23
  Top 0.381: JP0.5 60.95,45.72 62.97,43.7 65.57,43.7 65.63,43.76 76.45,43.76 78.06,45.37 U$1.7
N$24
  Top 0.381: JP0.7 60.95,48.26 62.06,49.37 78.06,49.37 U$1.3
N$25
  Top 0.381: SER0.6 C11.1
N$26
  Top 0.381: 92.71,15.24 D3.A
  Top 1.422: T4.3 92.71,15.24
  Bottom 0.381: 95.89,17.56 95.25,16.93
  Bottom 1.422: FAN.2 95.89,17.56 | 95.25,16.93 T4.3
N$27
  Top 0.381: R20.1 R21.1 R22.1 R23.1
  Bottom 0.381: U$2.15 71.71,64.67 71.71,64.15 69.79,62.23 R20.1
N$28
  Top 0.381: R27.1 R26.1 R25.1 R24.1 69.79,69.85 70.96,68.67 U$2.11
N$29
  Top 0.381: U$2.23 71.71,56.67 70.6,57.78 R28.2
N$30
  Top 1.626: MOTOR1.1 92.77,60.79 89.89,63.67 U$2.16
N$31
  Top 1.626: MOTOR1.2 92.77,64.29 91.39,65.67 U$2.14
N$32
  Top 1.626: MOTOR1.3 92.77,67.79 92.66,67.67 U$2.12
N$33
  Top 1.626: MOTOR1.4 92.77,71.29 91.16,69.67 80.04,69.67 U$2.10
N$34
  Top 0.381: U$2.19 69.56,60.67 C16.1
  Bottom 0.381: R29.1 C16.1
N$35
  Top 0.381: R30.2 60.96,73.6 61.34,73.6 62.23,74.49 T1.3
N$36
  Bottom 0.381: R31.1 68.58,76.14 67.31,77.41 T1.2
N$37
  Top 0.381: U$2.5 71.71,74.67 70.7,73.66 T1.1
N$38
  Top 0.381: JP1.1 55.23,70.48 59.23,70.48 59.8,71.06 71.33,71.06 71.71,70.67 U$2.9
N$39
  Top 0.381: JP1.3 55.23,73.03 55.23,73.91 61.58,80.26 74.34,80.26 75.71,78.89 75.71,71.67 U$2.8
N$40
  Bottom 0.381: JP1.5 55.23,75.56 56.71,77.04 64.55,77.04 67.93,73.66 70.73,73.66 71.71,72.67 U$2.7
N$41
  Bottom 0.381: JP1.7 55.23,78.11 57.35,80.23 68.16,80.23 71.71,76.67 U$2.3
N$42
  Top 0.381: R32.1 R33.1 R34.1 R35.1
  Bottom 0.381: U$3.15 27.98,68.67 27.98,69.83 29.91,71.75 R32.1
N$43
  Top 0.381: U$3.11 29.37,64.67 29.91,64.14 R39.1 R38.1 R37.1 R36.1
N$44
  Top 0.381: R40.2 34.99,76.2 34.51,76.67 U$3.23
N$45
  Top 1.626: MOTOR2.1 6.92,70.66 7.9,69.67 U$3.16
N$46
  Top 1.626: U$3.14 7.44,67.67 6.92,67.16 MOTOR2.2
N$47
  Top 1.626: MOTOR2.3 17.63,63.66 19.65,65.67 U$3.12
N$48
  Top 1.626: MOTOR2.4 6.92,60.16 8.44,61.67 18.9,61.67 20.9,63.67 U$3.10
N$49
  Top 0.381: U$3.19 29.5,72.67 C21.1
  Bottom 0.381: R41.1 C21.1
N$50
  Bottom 0.381: T2.3 38.73,56.52 R42.2
N$51
  Bottom 0.381: T2.2 31.11,56.52 R43.1
N$52
  Bottom 0.381: U$3.5 27.98,58.67 29.63,60.33 T2.1
N$53
  Top 0.381: JP2.1 44.46,62.87 44.33,63 39.34,63 39.2,62.87 28.17,62.87 27.98,62.67 U$3.9
N$54
  Top 0.381: U$3.8 23.98,61.67 23.98,54.44 24.98,53.45 45.7,53.45 47,54.74 47,55.85 47.67,56.52 48.84,56.52 49.52,57.2 49.52,60.85 48.78,61.59 46.99,61.59 JP2.3
N$55
  Top 0.381: JP2.5 44.46,57.78 44.36,57.68 30.71,57.68 27.98,60.41 27.98,60.67 U$3.7
N$56
  Top 0.381: JP2.7 44.46,55.24 42.97,56.74 28.05,56.74 27.98,56.67 U$3.3
N$57
  Top 0.381: R44.1 R45.1 R46.1 R47.1
  Bottom 0.381: U$4.15 21.63,40.73 21.63,41.89 23.56,43.81 R44.1
N$58
  Top 0.381: R48.1 R49.1 R50.1 R51.1
  Bottom 0.381: R51.1 23.56,36.2 23.02,36.73 U$4.11
N$59
  Top 0.381: R52.2 28.64,48.26 28.16,48.73 U$4.23
N$60
  Top 1.626: U$4.16 13.3,41.73 10.42,44.62 MOTOR3.1
N$61
  Top 1.626: U$4.14 8.31,39.73 6.92,41.12 MOTOR3.2
N$62
  Top 1.626: MOTOR3.3 6.92,37.62 7.04,37.73 U$4.12
N$63
  Top 1.626: MOTOR3.4 6.92,34.12 8.54,35.73 U$4.10
N$64
  Bottom 0.381: 26,47.66 25.91,47.75 24.15,47.75 21.63,45.23 21.63,44.73 U$4.19 | C26.1 26,47.66 | 26,47.66 27.3,48.96 R53.1
N$65
  Top 0.381: T3.3 32.38,27.3 R54.2
N$66
  Top 0.381: R55.1 24.77,29.91 26.04,28.64 T3.2
N$67
  Top 0.381: U$4.5 21.63,30.73 23.28,32.38 27.3,32.38 T3.1
N$68
  Bottom 0.381: JP3.1 38.11,34.92 37.98,35.06 33.62,35.06 33.49,34.92 21.82,34.92 21.63,34.73 U$4.9
N$69
  Bottom 0.381: U$4.8 17.63,33.73 17.63,26.52 19.62,24.53 31.89,24.53 33.37,26.01 39.92,26.01 40.64,26.73 40.64,30.41 39.92,31.13 39.37,31.13 JP3.3
N$70
  Bottom 0.381: JP3.5 38.11,29.84 37.85,29.58 24.52,29.58 21.63,32.46 21.63,32.73 U$4.7
N$71
  Bottom 0.381: JP3.7 38.11,27.3 36.68,28.73 U$4.3
N$73
  Bottom 0.381: R56.2 93.98,11.37 96.65,14.03 97.79,14.03 T4.2
RESET
  Top 0.381: IC1.9 59.69,7.02 61.47,5.24 61.47,1.91 62.33,1.05 67.12,1.05 68.6,2.54 | 68.6,2.54 70.07,2.54 70.23,2.38 74.83,2.38 74.99,2.54 R1.2 | J1.5 68.6,2.54
  Bottom 0.381: R1.2 89.53,2.54 C11.2
SCK
  Bottom 0.381: J1.3 66.04,1.05 54.94,1.05 54.61,1.38 X_MIN.1 54.61,6.24 56.36,6.24 57.15,7.02 IC1.8
SERIAL_RX
  Top 0.381: SER0.4 86.13,2.95 78.6,2.95 77.73,3.81 75.7,3.81 74.19,5.31 74.19,7.09 IC1.14
SERIAL_TX
  Top 0.381: IC1.15 74.93,7.02 87.59,7.02 SER0.5
STEP0
  Bottom 0.381: IC1.25 77.47,26 78.06,26.59 78.06,31.37 U$1.21
STEP1
  Bottom 0.381: IC1.29 67.31,26 69.16,27.84 69.16,31.32 66.09,34.38 66.09,35.49 66.85,36.26 67.84,36.26 68.58,37 68.58,46.15 71.71,49.28 71.71,58.67 U$2.21
STEP2
  Bottom 0.381: IC1.35 52.07,48.91 46.99,53.99 46.99,68.67 48.23,69.9 48.23,76.55 45.45,79.32 30.58,79.32 27.98,76.73 27.98,74.67 U$3.21
STEP3
  Top 0.381: IC1.37 46.99,26 | U$4.21 21.63,46.73 21.63,45.24 24.39,42.48 25.31,42.48 26.1,41.7 26.1,40.74 26.84,40.01 32.83,40.01 37.47,35.36 37.47,35.04 38.87,33.64 39.97,33.64 40.65,32.96 40.65,31.86 41.4,31.11 42.42,31.11 46.99,26.55 46.99,26 | 46.99,26
TEMP0
  Top 0.381: R16.2 34.23,20.95 35.53,22.26 44.45,22.26 IC1.38
  Bottom 0.381: 31.75,20.95 C8.1 | 31.75,20.95 32,20.95 R16.2 | 31.75,20.95 31.75,20.84 29.84,18.94 TEMP0.1
TEMP1
  Top 0.381: C10.1 30.48,8.15 31.28,8.15 31.81,7.62 | 31.81,7.62 32,7.62 R19.2 | TEMP1.1 30.48,6.24 31.81,7.57 31.81,7.62
  Bottom 0.381: R19.2 33.02,8.83 33.4,8.83 41.91,17.34 IC1.39
V+
  Top 1.626: R18.1 12.14,2.54 11.51,1.91 D2.C | C13.1 84.17,57.78 82.28,59.67 U$2.20 | U$3.20 15.31,73.67 14.69,74.3 C18.1 | 13.97,14.56 13.93,14.61 D1.C | 13.97,14.56 13.97,13.41 14.48,12.9 84.15,12.9 92.84,21.59 FAN.1 | R15.1 13.97,14.56 | U$4.20 13.3,45.73 8.24,50.8 7.71,50.8 C23.1 C25.1 | U$2.6 80.04,73.67 80.69,73.03 C12.1 89.53,73.03 C14.1 | C5.1 C3.1 90.81,48.26 | 90.81,48.26 88.28,48.26 86.39,46.37 U$1.6 | C15.1 90.81,48.26 | C19.1 10.16,59.05 C17.1 | C24.1 C22.1 7.71,30.48 8.96,31.73 U$4.6
  Bottom 1.626: 96.66,26.62 95.97,27.3 C4.1 91.99,27.3 | C6.1 97.1,26.62 96.66,26.62 | 96.66,26.62 96.66,24.47 95.89,23.7 FAN.1 | 87.78,57.93 88.99,59.14 88.99,69.04 87,71.03 C12.1 | C13.1 87.63,57.78 87.78,57.93 | C15.1 90.46,55.24 87.78,57.93 | 17.85,56.66 20.67,53.84 22.81,53.84 23.83,52.82 38.03,52.82 43.62,58.4 43.62,72.35 V+.2 | 9.8,14.61 7.86,12.66 7.86,11.19 HEATER1.1 5.08,6.59 5.48,6.59 D2.C | D1.C 9.8,14.61 | 9.8,14.61 7.56,16.85 7.56,17.3 HEATER0.1 | 88.09,32.37 88.09,31.2 91.99,27.3 | C3.1 88.09,42.37 88.09,32.37 | U$1.20 88.09,32.37 | 91.99,27.3 91.99,24.85 D3.C | 10.71,74.3 10.71,72.94 8.26,70.48 C19.1 7.92,57.15 5.71,54.95 C23.1 | 10.71,74.3 8.8,76.2 C20.1 | C18.1 10.71,74.3 | U$4.20 13.3,45.73 13.3,31.73 | 13.3,31.73 13.8,31.73 U$4.6 | R15.1 13.97,17.07 13.3,17.73 13.3,31.73 | 17.85,56.66 17.09,56.66 14.69,59.05 C17.1 | 17.85,56.66 19.65,58.46 19.65,59.67 U$3.6
  pour Top (no thermals): 0,81.28 99.69,81.28 99.69,0 0,0
Z_MIN
  Bottom 0.381: IC1.2 41.91,7.02 41.12,6.24 36.83,6.24 Z_MIN.1

### Text on the board
tNames: R32-R39 1 | R20-R27 1 | R44-R51 1 | R2-R9 1 | FAN | TEMP0 | TEMP1
_tsilk: GND | Stepping | 4 | Torque | 2,3 | 16X | 1,3 | 8X | 3 | 4X | 1,2 | 2X B | 2 | 2X A | 1 | 1X | open hw | github.com/atom-bomb/sandwich | GND | V+ | GND | V+ | GND | V+ | RST | Z | GND | 5v | Y | GND | 5v | X | GND | 5v | GND | GND | 5v
200bmp: acemonstertoys.org